# EAGLE schematic UKW-Pendler (EAGLE 7.6.0)
http://www.b-kainka.de/Weblog/HF/UKWpendler.html
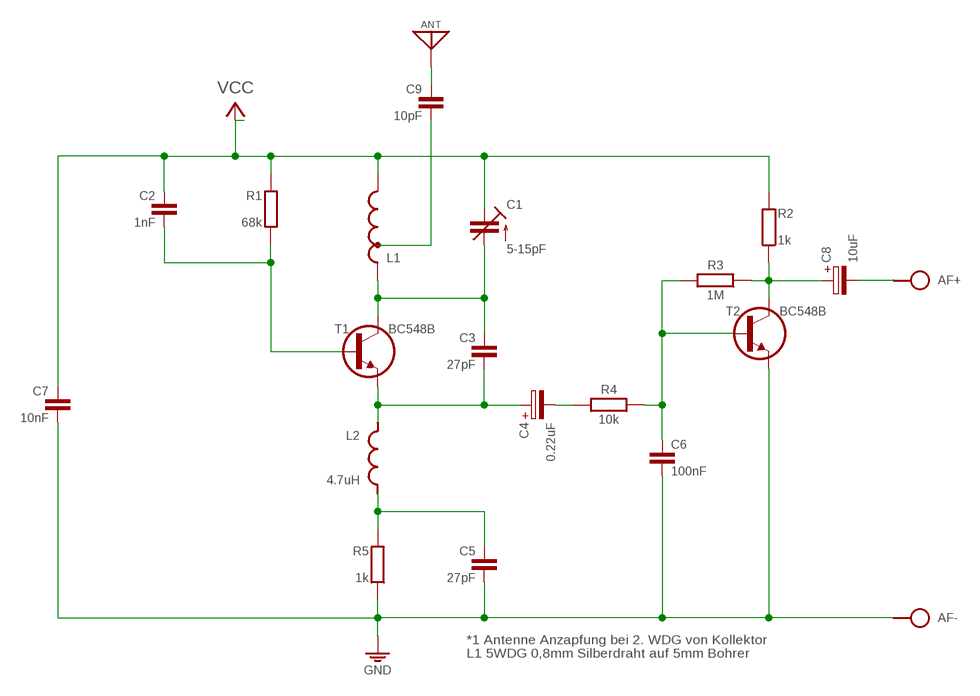
[diagram p0: schematic, sheet 1]

## Parts
AF  SPAD+-+-  [SPAD+-]
ANT  ANT  [SPAD]
C1  5-15pF  C-TR-PH201272222-808-2PINB  [TRIM-2222-808]
C2  1nF  C050-020X036/V  [C050-020X036/V]
C3  27pF  C050-020X036/V  [C050-020X036/V]
C4  0.22uF  CPOLE2,5-4  [E2,5-4]
C5  27pF  C050-020X036/V  [C050-020X036/V]
C6  100nF  C050-020X036/V  [C050-020X036/V]
C7  10nF  C050-020X036/V  [C050-020X036/V]
C8  10uF  CPOLE2,5-4  [E2,5-4]
C9  10pF  C050-020X036/V  [C050-020X036/V]
J1  VCC_GNDPWR-L  [PWR-L]
L1  L-TAP104/7  [L-04/7-TAP1]
L2  4.7uH  L-SHORT02/5  [L-02/5V]
R1  68k  R0204/10-V  [0204/10-V]
R2  1k  R0204/10-V  [0204/10-V]
R3  1M  R-H0204/10  [0204/10]
R4  10k  R-H0204/10  [0204/10]
R5  1k  R0204/10-V  [0204/10-V]
T1  BC548B  BC547CBE  [TO92-CBE]
T2  BC548B  BC547CBE  [TO92-CBE]

## Nets
GND: AF.1 C5.2 C6.2 C7.2 J1.1 R5.2 T2.E
N$1: ANT.1 C9.1
N$2: C3.2 C4.+ L2.2 T1.E
N$3: C1.2(A) C3.1 L1.1 T1.C
N$4: C4.- R4.2
N$5: C6.1 R3.2 R4.1 T2.B
N$6: C5.1 L2.1 R5.1
N$8: C2.2 R1.2 T1.B
N$9: C8.+ R2.2 R3.1 T2.C
N$10: AF.2 C8.-
N$12: C9.2 L1.T
N$13: C1.3(E) C2.1 C7.1 L1.2 R1.1 R2.1
Unconnected: J1.2

## Notes on the sheet
- *1 Antenne Anzapfung bei 2. WDG von Kollektor
  L1 5WDG 0,8mm Silberdraht auf 5mm Bohrer

## Library data of the parts
AF = pad:SPAD+-
ANT = pad:ANT
C1 = cap-trim:C-TR-PH20127
C2 C3 C5-C7 C9 = c:C: CAPACITOR, European symbol
C4 C8 = c:CPOL: POLARIZED CAPACITOR, European symbol
J1 = pad:VCC_GND
L1 = l:L-TAP1
L2 = l:L-SHORT
R1 R2 R5 = r:R: RESISTOR, European symbol
R3 R4 = r:R-H
T1 T2 = t:BC547